# Altium schematic sheet ADC.SCHDOC
size A
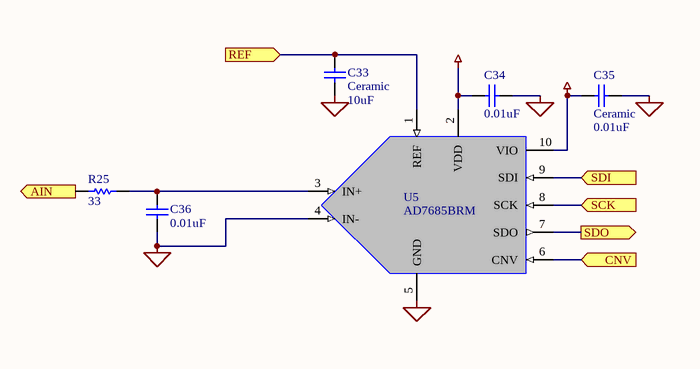
[diagram p0: ADC.SCHDOC]

## Parts
C33  Ceramic  value 10uF  [0805]
C34  value 0.01uF  [0603]  (hidden comment: Cap)
C35  Ceramic  value 0.01uF  [0603]
C36  value 0.01uF  [0603]  (hidden comment: Cap)
R25  value 33  [0603]  (hidden comment: Res1)
U5  AD7685BRM  [AD RM-10]

## Ports
AIN (in), CNV (in), REF (in), SCK (in), SDI (in), SDO (out)

## Nets
AGND: C33.1 C34.2 C35.1 C36.1 U5.4(IN-) U5.5(GND)
AVDD: C34.1 C35.2 U5.2(VDD) U5.10(VIO)
AIN: R25.1 ; port AIN
CNV: U5.6(CNV) ; port CNV
REF: C33.2 U5.1(REF) ; port REF
SCK: U5.8(SCK) ; port SCK
SDI: U5.9(SDI) ; port SDI
SDO: U5.7(SDO) ; port SDO
NetC36_2: C36.2 R25.2 U5.3(IN+)

## Library data of the parts
C33-C36 = Cap: Capacitor; Published: 8-Jun-2000; LatestRevisionDate: 17-Jul-2002; LatestRevisionNote: Re-released for DXP Platform.; Publisher: Altium Limited
R25 = Res1: Resistor; Published: 8-Jun-2000; LatestRevisionDate: 17-Jul-2002; LatestRevisionNote: Re-released for DXP Platform.; Publisher: Altium Limited
U5 = AD7685: AD 16-bit 250 kSPS ADC; Vendor: Analog Devices